# EAGLE schematic band_pass_filter (EAGLE 6.2)
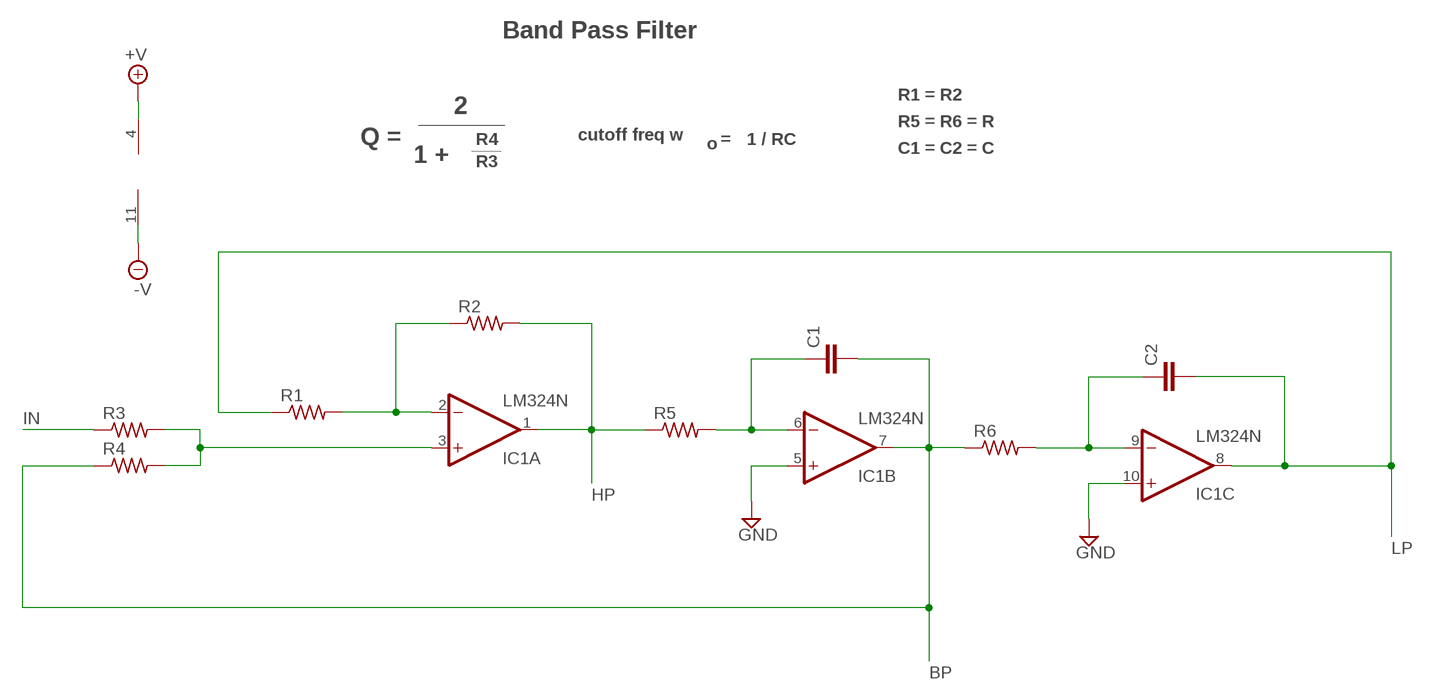
[diagram p0: schematic, sheet 1]

## Parts
C1  CERAMIC_CAPACITOR  [CERAMIC_CAP]
C2  CERAMIC_CAPACITOR  [CERAMIC_CAP]
IC1  LM324N  [DIL14]
R1  RESISTOR  [RESISTOR]
R2  RESISTOR  [RESISTOR]
R3  RESISTOR  [RESISTOR]
R4  RESISTOR  [RESISTOR]
R5  RESISTOR  [RESISTOR]
R6  RESISTOR  [RESISTOR]

## Nets
+9V: IC1.4(P:V+) ; supply symbol labelled +V
-9V: IC1.11(P:V-) ; supply symbol labelled -V
BP: C1.2 IC1.7(B:OUT) R4.1 R6.1
GND: IC1.5(B:+IN) IC1.10(C:+IN)
HP: IC1.1(A:OUT) R2.2 R5.1
IN: R3.1
LP: C2.2 IC1.8(C:OUT) R1.1
N$1: IC1.2(A:-IN) R1.2 R2.1
N$3: IC1.3(A:+IN) R3.2 R4.2
N$4: C1.1 IC1.6(B:-IN) R5.2
N$6: C2.1 IC1.9(C:-IN) R6.2
Unconnected: IC1.12(D:+IN) IC1.13(D:-IN) IC1.14(D:OUT)

## Notes on the sheet
- Band Pass Filter
- R1 = R2
- 2
- ______ | R5 = R6 = R
- Q = | R4 | cutoff freq w | = | 1 / RC
- ___ | o | C1 = C2 = C
- 1 + | R3

## Library data of the parts
C1 C2 = 00_steve:CERAMIC_CAPACITOR
IC1 = gm-ics:LM324: OP AMP
R1-R6 = 00_steve:RESISTOR